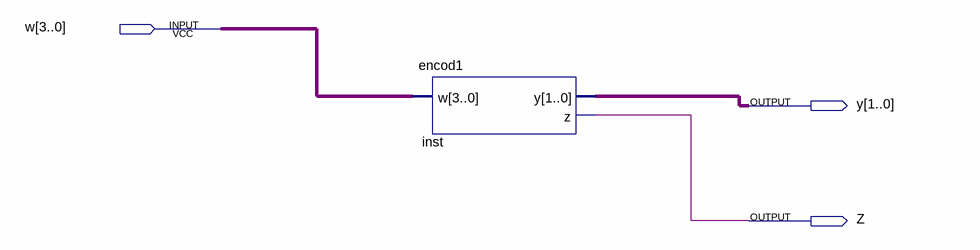
[diagram p0: schematic sheet]
// Quartus schematic encode.bdf as structural Verilog: 1 symbols, 3 pins
module encode (
  input  [3:0] w,
  output [1:0] y,
  output Z
);

  encod1 inst (.w(w), .y(y), .z(Z));
endmodule
